# Altium schematic sheet TempSensor.SchDoc
size 420 x 297 mm
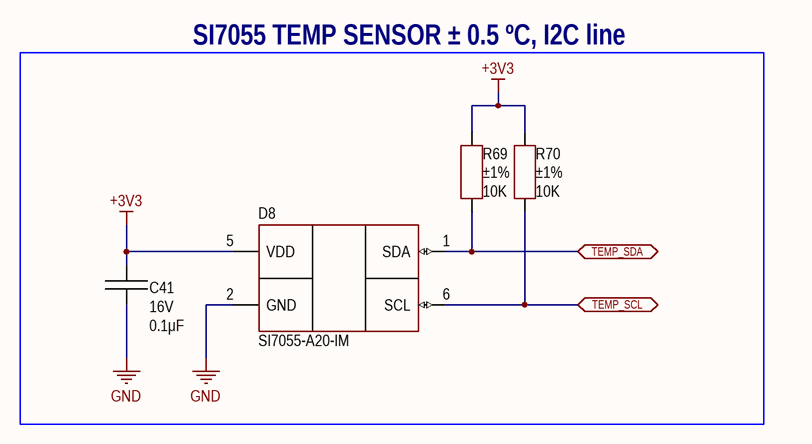
[diagram p0: TempSensor.SchDoc]

## Parts
C41  value 0.1μF  Voltage: 16V  [CAP: 0402]
D8  (no value)  [6-WDFN(3x3)]
R69  value 10K  Tolerance: ±1%  [RES: 0402]
R70  value 10K  Tolerance: ±1%  [RES: 0402]

## Blocks framed on the sheet
SI7055 TEMP SENSOR ± 0.5 ºC, I2C line: C41 D8 R69 R70

## Ports
TEMP_SCL (bidir), TEMP_SDA (bidir)

## Nets
+3V3: C41.2 D8.5(VDD) R69.2 R70.2
GND: C41.1 D8.2(GND)
TEMP_SCL: D8.6(SCL) R70.1 ; port TEMP_SCL
TEMP_SDA: D8.1(SDA) R69.1 ; port TEMP_SDA

## Notes on the sheet
- Author
- Manufacturer
- Date
- Page
- Total pages
- Size page
- A3
- Materials

## Library data of the parts
C41 = Ceramic_0402: ±10% 16V Ceramic Capacitor X7R 0402 (1005 Metric); Manufacturer: Yageo; PartNumber: CC0402KRX7R7BB104; ValueManufacturerPartNumber: Ceramic capacitor, 0.1μF, X7R, ±10%, 16V, 0402, -55...+125°C; Package: 0402; HelpURL: https://www.digikey.com/product-detail/en/yageo/CC0402KRX7R7BB104/311-1338-1-ND/2103122; Temperature: -55...+125°C; TypeCapacitor: Ceramic capacitor; Tolerance: ±10%; TypeDielectric: X7R
D8 = SI7055-A20-IM: Temperature sensor; Manufacturer: Silicon Labs; Supply: 1.9...3.6V; Accuracy: ±0.5°C; Sensing: Digital sensor; HelpURL: https://www.digikey.com/en/products/detail/silicon-labs/SI7055-A20-IM/5025891; Package: 6-WDFN; ComponentType: IC temperature sensor; ValueManufacturerPartNumber: =ComponentType+', '+Sensing+', '+Accuracy+', '+GainBandwidth+', '+Sensitivity+', '+Temperature+', '+Package; Temperature: -40...+125°C; PartNumber: SI7055-A20-IM
R69 R70 = Resistor_0402: 10 kOhms ±1% 0.063W, 1/16W Chip Resistor 0402 (1005 Metric) Moisture Resistant Thick Film; Manufacturer: Yageo; PartNumber: RC0402FR-0710KL; ValueManufacturerPartNumber: Resistor film, 10K, ±1%, 0402, 0.063W, -55...+125°C; TypeResistor: Resistor film; Package: 0402; HelpURL: https://www.digikey.com/en/products/detail/yageo/RC0402FR-0710KL/726523; Temperature: -55...+125°C; Power: 0.063W